# EAGLE design pressure (EAGLE 7.1.0)
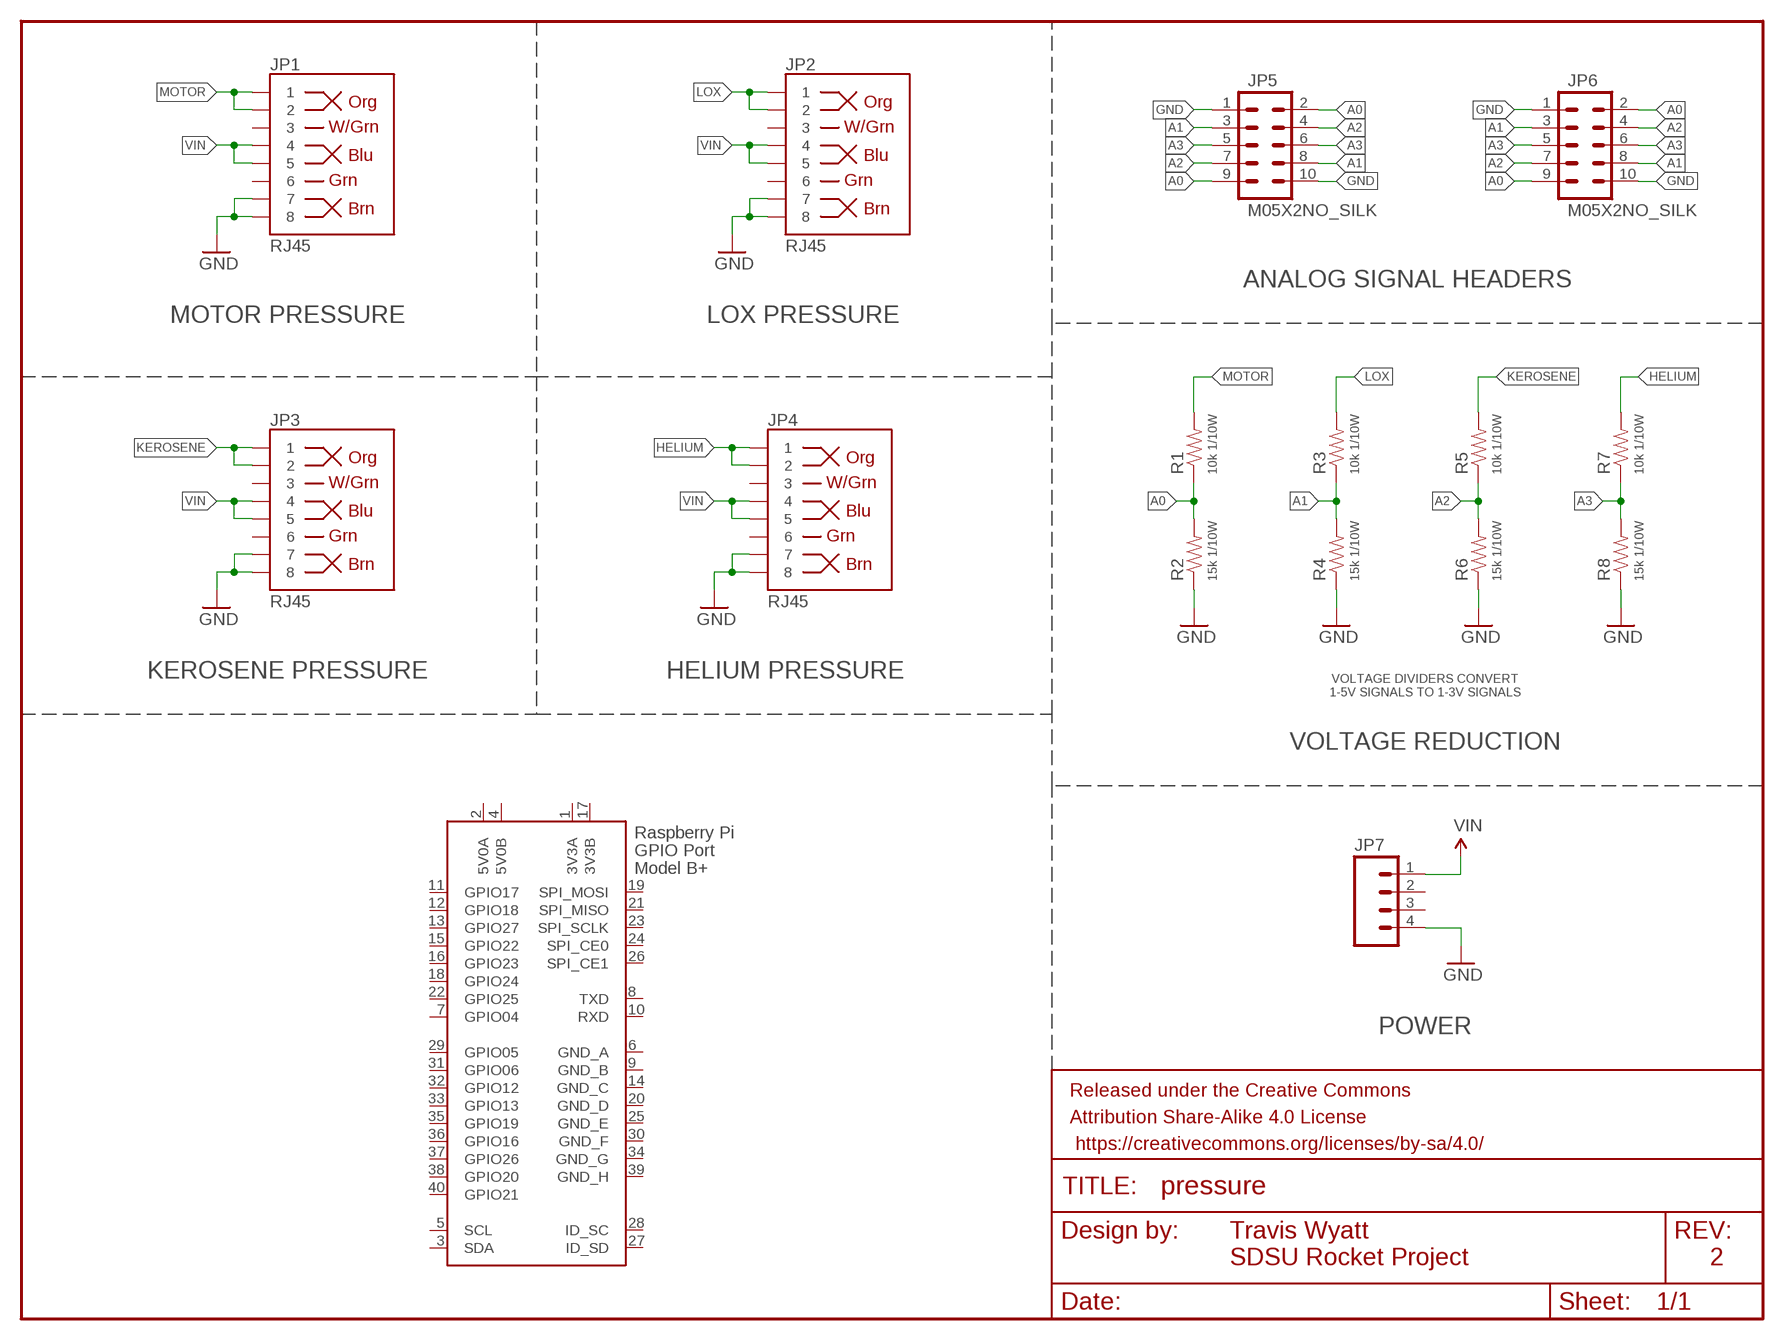
[diagram p0: schematic, sheet 1]

## Parts
FRAME1  FRAME-LETTER  [CREATIVE_COMMONS]
JP1  RJ45  RJ45-8PTH  [RJ45-8]
JP2  RJ45  RJ45-8PTH  [RJ45-8]
JP3  RJ45  RJ45-8PTH  [RJ45-8]
JP4  RJ45  RJ45-8PTH  [RJ45-8]
JP5  M05X2NO_SILK  [2X5_NOSILK]
JP6  M05X2NO_SILK  [2X5_NOSILK]
JP7  JST-4POS-2.5MM  [S4B-XH-SM4-TB]
R1  10k 1/10W  RESISTOR0603-RES  [0603-RES]
R2  15k 1/10W  RESISTOR0603-RES  [0603-RES]
R3  10k 1/10W  RESISTOR0603-RES  [0603-RES]
R4  15k 1/10W  RESISTOR0603-RES  [0603-RES]
R5  10k 1/10W  RESISTOR0603-RES  [0603-RES]
R6  15k 1/10W  RESISTOR0603-RES  [0603-RES]
R7  10k 1/10W  RESISTOR0603-RES  [0603-RES]
R8  15k 1/10W  RESISTOR0603-RES  [0603-RES]
X1  RASPI_BOARD_B+#_H  [RASPI_BOARD_B+HAT]

## Nets
A0: JP5.2 JP5.9 JP6.2 JP6.9 R1.1 R2.2
A1: JP5.3 JP5.8 JP6.3 JP6.8 R3.1 R4.2
A2: JP5.4 JP5.7 JP6.4 JP6.7 R5.1 R6.2
A3: JP5.5 JP5.6 JP6.5 JP6.6 R7.1 R8.2
GND: JP1.7 JP1.8 JP2.7 JP2.8 JP3.7 JP3.8 JP4.7 JP4.8 JP5.1 JP5.10 JP6.1 JP6.10 JP7.4 R2.1 R4.1 R6.1 R8.1
HELIUM: JP4.1 JP4.2 R7.2
KEROSENE: JP3.1 JP3.2 R5.2
LOX: JP2.1 JP2.2 R3.2
MOTOR: JP1.1 JP1.2 R1.2
VIN: JP1.4 JP1.5 JP2.4 JP2.5 JP3.4 JP3.5 JP4.4 JP4.5 JP7.1
Unconnected: JP1.3 JP1.6 JP2.3 JP2.6 JP3.3 JP3.6 JP4.3 JP4.6 JP7.2 JP7.3 X1.3(SDA) X1.5(SCL) X1.7(GPIO04) X1.8(TXD) X1.10(RXD) X1.11(GPIO17) X1.12(GPIO18) X1.13(GPIO27) X1.15(GPIO22) X1.16(GPIO23) X1.18(GPIO24) X1.19(SPI_MOSI) X1.21(SPI_MISO) X1.22(GPIO25) X1.23(SPI_SCLK) X1.24(SPI_CE0) X1.26(SPI_CE1) X1.27(ID_SD) X1.28(ID_SC) X1.29(GPIO05) X1.31(GPIO06) X1.32(GPIO12) X1.33(GPIO13) X1.35(GPIO19) X1.36(GPIO16) X1.37(GPIO26) X1.38(GPIO20) X1.40(GPIO21)

## Notes on the sheet
- ANALOG SIGNAL HEADERS
- MOTOR PRESSURE | LOX PRESSURE
- KEROSENE PRESSURE | HELIUM PRESSURE
- VOLTAGE DIVIDERS CONVERT
  1-5V SIGNALS TO 1-3V SIGNALS
- VOLTAGE REDUCTION
- POWER
- Travis Wyatt
- SDSU Rocket Project
- 2

## Power pins joined to a net without a drawn wire
3V3A: X1.1(3V3A)
3V3B: X1.17(3V3B)
5V0A: X1.2(5V0A)
5V0B: X1.4(5V0B)
GND_A: X1.6(GND_A)
GND_B: X1.9(GND_B)
GND_C: X1.14(GND_C)
GND_D: X1.20(GND_D)
GND_E: X1.25(GND_E)
GND_F: X1.30(GND_F)
GND_G: X1.34(GND_G)
GND_H: X1.39(GND_H)

## Library data of the parts
FRAME1 = SparkFun-Aesthetics:FRAME-LETTER: Schematic Frame Standard 8.5x11 US Letter frame; DESIGNER: NAME; VERSION: v01
JP1-JP4 = SparkFun-Connectors:RJ45-8: RJ45 Jack Simple RJ45, 8-pin connection - connector for common Cat5, Cat5e, and Cat6 Ethernet cables. Footprint not yet proven in production. Connector sku is PRT-00643; Breakout PCB sku is BOB-00716.; PROD_ID: CONN-08506
JP5 JP6 = SparkFun-Connectors:M05X2: Header 5x2 Standard 10-pin dual row 0.1" header. Commonly used with AVR-ISP. Use with Spark Fun Electronics SKU: PRT-00778
JP7 = SDSURocket-Connectors:JST-4POS: JST 4-position XH SMD Header 2.5mm pitch/Disconnectable Crimp style connector DigiKey Part Number: 455-2262-1-ND <http://www.digikey.com/product-detail/en/S4B-XH-SM4-TB(LF)(SN)/455-2262-1-ND/1651060> Datasheet: eXH.pdf <http://www.jst-mfg.com/product/pdf/eng/eXH.pdf>
R1-R8 = SparkFun-Resistors:RESISTOR: Resistor Basic schematic elements and footprints for 0603, 1206, and PTH resistors.
X1 = raspberrypi_bastelstube_v13:RASPI_BOARD_B+#: Raspberry Pi GPIO connector with markings for the outer dimensions of the Raspberry Pi board model B+ with different sets of drill holes or mounting pads All pins connected

## Net classes
1 5V Power: width 0.61 mm

## Board
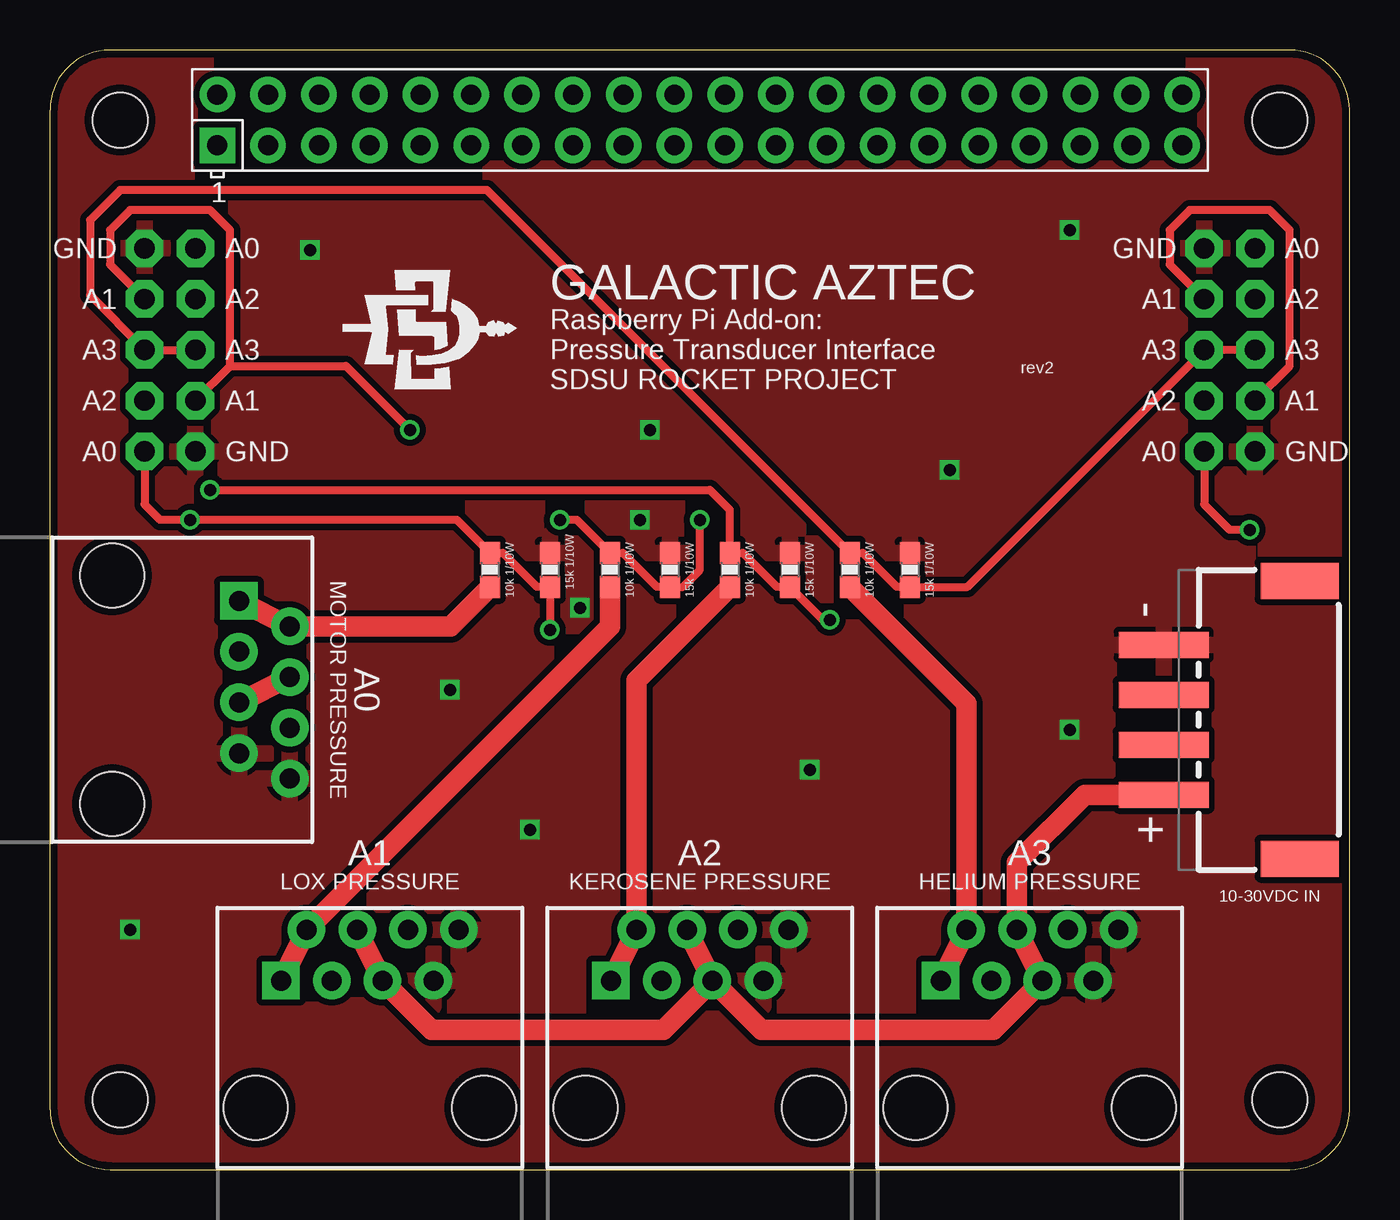
[diagram p1: board, top side]
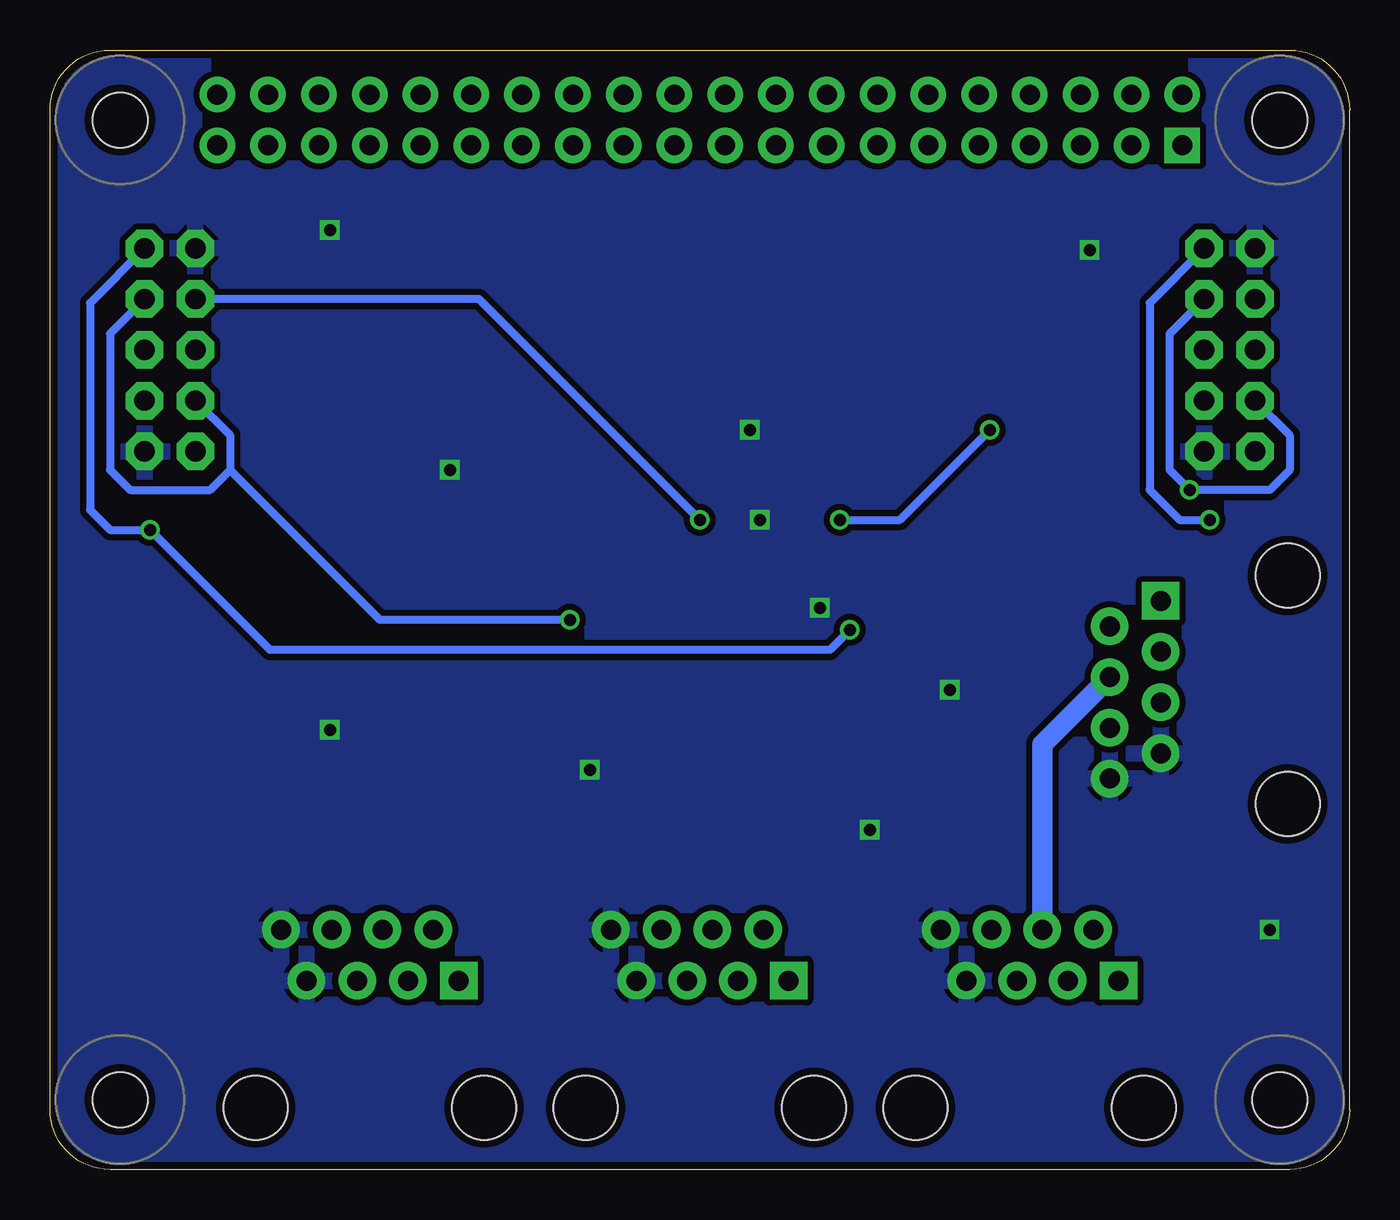
[diagram p2: board, bottom side, seen from below]

Size 65 x 56 mm. Coordinates in mm from the lower left corner, seen from the top.
Copper layers (1*16): Top 0.0356mm / dielectric 1.5011mm / Bottom 0.0356mm
Design rules "SparkFunBestPractices *": minimum track width 10mil, minimum drill 13mil, track to track 12mil, track to pad 12mil, pad to pad 12mil, via to via 12mil, smd to smd 12mil, copper to edge 15mil, drill to drill 12mil, minimum pad ring 7mil, minimum via ring 7mil, stop-mask expansion 3mil, vias tented up to drill 0mil, thermal gap 10mil

### Footprints (pad centres in the part's own frame; a part is rotated, then mirrored left to right if it is on the bottom)
RJ45-8 = drill 1 pad 1.88 square: 1 -4.445,6.35 | drill 1 pad 1.88: 2 -3.175,8.89; 3 -1.905,6.35; 4 -0.635,8.89; 5 0.635,6.35; 6 1.905,8.89; 7 3.175,6.35; 8 4.445,8.89 | hole 3.2: -5.715,0; 5.715,0
2X5_NOSILK = drill 1.016 pad 1.88 octagon: 1 -1.27,5.08; 2 1.27,5.08; 3 -1.27,2.54; 4 1.27,2.54; 5 -1.27,0; 6 1.27,0; 7 -1.27,-2.54; 8 1.27,-2.54; 9 -1.27,-5.08; 10 1.27,-5.08
S4B-XH-SM4-TB = smd 1.3 x 4.5: 1 -3.75,6.8; 2 -1.25,6.8; 3 1.25,6.8; 4 3.75,6.8 | smd 1.8 x 3.9: NC1 -6.95,0; NC2 6.95,0
0603-RES = smd 1.1 x 1: 1 -0.85,0; 2 0.85,0
RASPI_BOARD_B+HAT = drill 1 pad 1.778 square: 1 8.37,51.23 | drill 1 pad 1.778: 2 8.37,53.77; 3 10.91,51.23; 4 10.91,53.77; 5 13.45,51.23; 6 13.45,53.77; 7 15.99,51.23; 8 15.99,53.77; 9 18.53,51.23; 10 18.53,53.77; 11 21.07,51.23; 12 21.07,53.77; 13 23.61,51.23; 14 23.61,53.77; 15 26.15,51.23; 16 26.15,53.77; 17 28.69,51.23; 18 28.69,53.77; 19 31.23,51.23; 20 31.23,53.77; 21 33.77,51.23; 22 33.77,53.77; 23 36.31,51.23; 24 36.31,53.77; 25 38.85,51.23; 26 38.85,53.77; 27 41.39,51.23; 28 41.39,53.77; 29 43.93,51.23; 30 43.93,53.77; 31 46.47,51.23; 32 46.47,53.77; 33 49.01,51.23; 34 49.01,53.77; 35 51.55,51.23; 36 51.55,53.77; 37 54.09,51.23; 38 54.09,53.77; 39 56.63,51.23; 40 56.63,53.77 | hole 2.75: 3.5,3.5; 3.5,52.5; 61.5,3.5; 61.5,52.5

### Placement (x,y rotation side)
FRAME1  0,-16 0 top  (outside the outline)
JP1  3.1,24 270 top
JP2  16,3.1 0 top
JP3  32.5,3.1 0 top
JP4  49,3.1 0 top
JP5  59,41 0 top
JP6  6,41 180 top
JP7  62.5,22.5 90 top
R1  22,30 270 top
R2  25,30 270 top
R3  28,30 270 top
R4  31,30 270 top
R5  34,30 270 top
R6  37,30 270 top
R7  40,30 270 top
R8  43,30 270 top
X1  0,0 0 top

### Tracks (layer width: path | path; a pad name or v marks a point on that pad's centre or on a via)
A0  (via drill 0.6)
  Top 0.406: v60,32 59,32 57.73,33.27 JP5.9 | JP6.2 4.73,33.27 5.5,32.5 v7,32.5 20.35,32.5 R1.1 22.65,30.85 24.35,29.15 R2.2 v25,27
  Bottom 0.406: JP5.2 63,43.35 63,33 62,32 v60,32 54,26 26,26 v25,27 | JP6.9 10,43.35 10,34 8.5,32.5 v7,32.5
A1  (via drill 0.6)
  Top 0.406: JP5.8 62,40.19 62,47 61,48 57,48 56,47 56,45.27 JP5.3 | JP6.3 9,40.19 | 9,40.19 9,47 8,48 4,48 3,47 3,45.27 JP6.8 | v25.5,32.5 26.35,32.5 R3.1 28.65,30.85 30.35,29.15 R4.2 31.65,29.15 32.5,30 v32.5,32.5 | 9,40.19 14.81,40.19 v18,37
  Bottom 0.406: v25.5,32.5 22.5,32.5 v18,37 | v32.5,32.5 43.54,43.54 JP5.3
A2  (via drill 0.6)
  Top 0.406: v8,34 33,34 34,33 R5.1 34.65,30.85 36.35,29.15 R6.2 38.65,27.5 v39,27.5
  Bottom 0.406: JP5.4 62,41.81 62,35 61,34 57,34 56,35 | JP5.7 56,36.73 56,35 | JP6.4 3,36.73 3,35 4,34 v8,34 9,35 9,41.81 JP6.7 | v39,27.5 48.5,27.5 56,35
A3
  Top 0.406: JP5.6 JP5.5 45.88,29.15 R8.2 42.35,29.15 40.65,30.85 R7.1 21.85,49 3.5,49 2,47.5 2,43.73 JP6.6 JP6.5
GND  (via drill 0.6)
  other vias: 26.5,28.1 29.5,32.5 4,12 24,17 20,24 38,20 51,22 45,35 30,37 13,46 51,47
  pour Bottom: 0,0 65,0 65,56 0,56
  pour Top: 0,0 65,0 65,56 0,56
HELIUM
  Top 1.016: JP4.1 JP4.2 45.83,23.32 R7.2
KEROSENE
  Top 1.016: JP3.1 JP3.2 29.32,24.48 R5.2
LOX
  Top 1.016: JP2.1 JP2.2 28,27.16 R3.2
MOTOR
  Top 1.016: JP1.1 JP1.2 20.02,27.18 R1.2
VIN
  Top 1.016: JP2.4 JP2.5 19.09,7 30.68,7 JP3.5 | JP3.4 JP3.5 | JP1.5 JP1.4 | JP3.5 35.59,7 47.19,7 JP4.5 JP4.4 48.37,15.37 51.75,18.75 JP7.1
  Bottom 1.016: JP2.4 15.37,21.26 JP1.4

### Text on the board
tNames: GND | A0 | GND | A0 | A1 | A2 | GALACTIC AZTEC | A1 | A2 | Raspberry Pi Add-on: | A3 | A3 | Pressure Transducer Interface | A3 | A3 | rev2 | SDSU ROCKET PROJECT | A2 | A1 | A2 | A1 | A0 | GND | A0 | GND | - | MOTOR PRESSURE | A0 | + | A1 | A2 | A3 | LOX PRESSURE | KEROSENE PRESSURE | HELIUM PRESSURE | 10-30VDC IN